# EAGLE design gigatron-sn76489 (EAGLE 9.6.2)
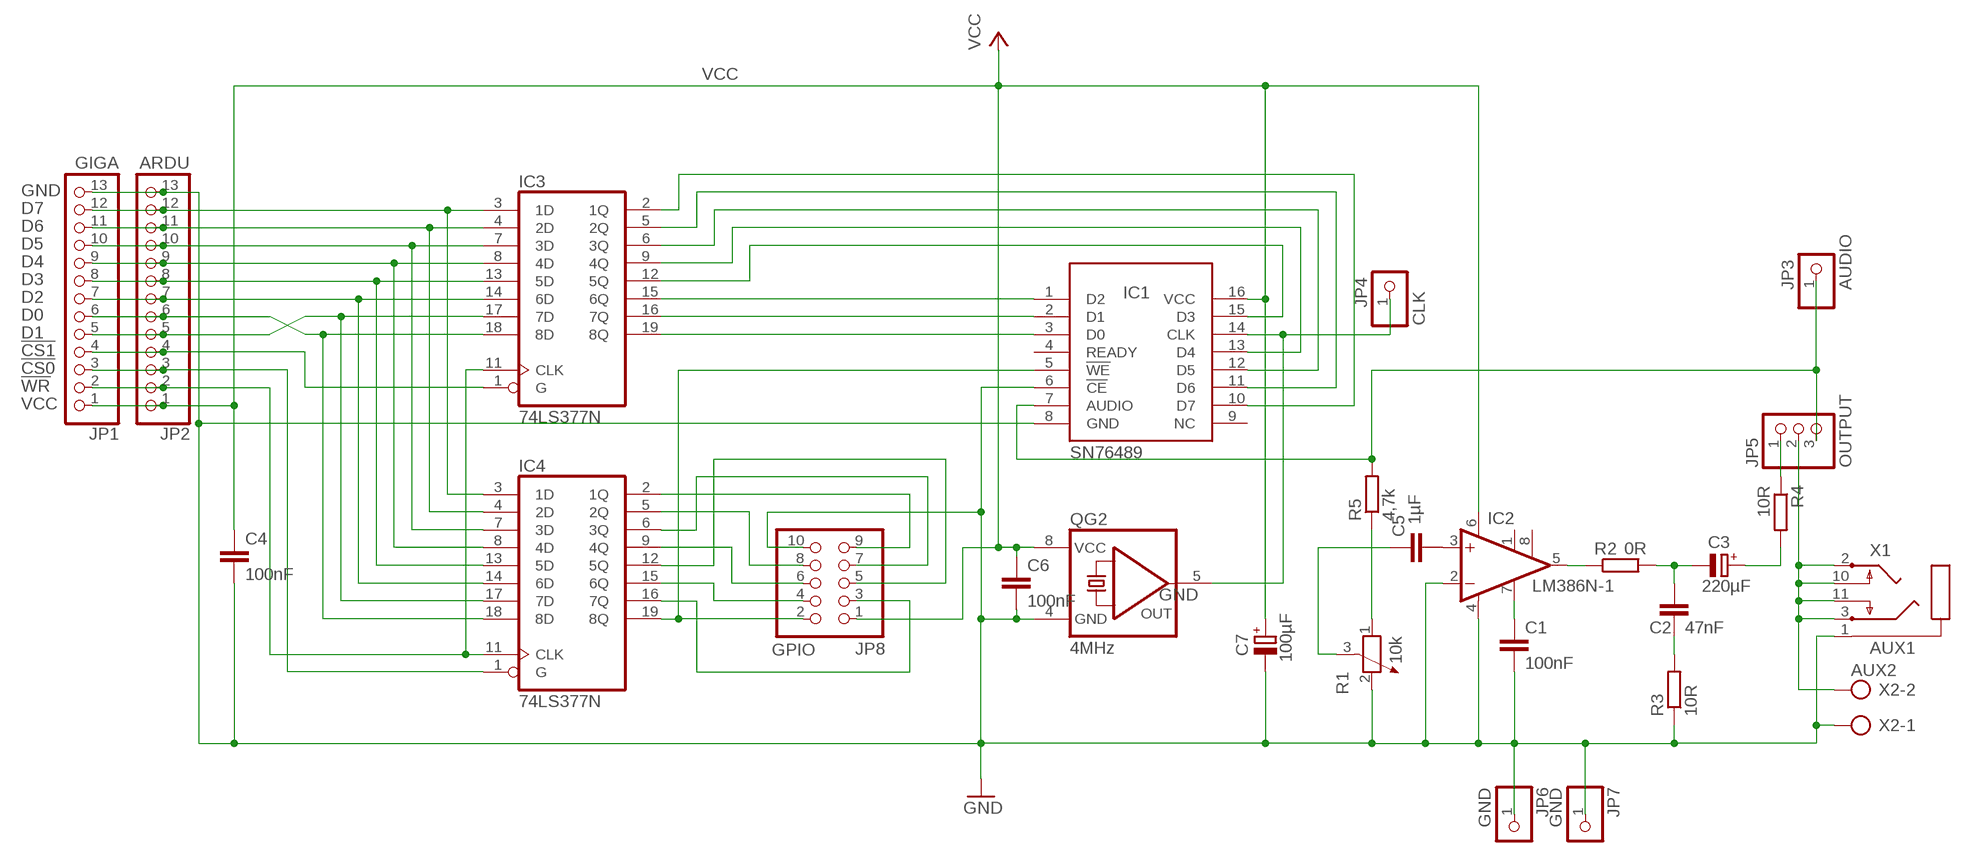
[diagram p0: schematic, sheet 1]

## Parts
C1  100nF  C-EU050-025X075  [C050-025X075]
C2  47nF  C-EU050-025X075  [C050-025X075]
C3  220µF  CPOL-EUE2.5-7  [E2,5-7]
C4  100nF  C-EU050-025X075  [C050-025X075]
C5  1µF  C-EU050-025X075  [C050-025X075]
C6  100nF  C-EU050-025X075  [C050-025X075]
C7  100µF  CPOL-EUE2.5-7  [E2,5-7]
IC1  SN76489  ALEX-PARTS_SN76489AN  [ALEX-PARTS_DIL16]
IC2  LM386N-1  [DIL08]
IC3  74LS377N  [DIL20]
IC4  74LS377N  [DIL20]
JP1  GIGA  PINHD-1X13/90  [1X13/90]
JP2  ARDU  PINHD-1X13  [1X13]
JP3  AUDIO  PINHD-1X1  [1X01]
JP4  CLK  PINHD-1X1  [1X01]
JP5  OUTPUT  PINHD-1X3  [1X03]
JP6  GND  PINHD-1X1  [1X01]
JP7  GND  PINHD-1X1  [1X01]
JP8  GPIO  PINHD-2X5  [2X05]
QG2  4MHz  QG5460  [DIL08S]
R1  10k  POTENTIOMETER_PT-10S  [PT-10S]
R2  0R  R-EU_0207/10  [0207/10]
R3  10R  R-EU_0207/10  [0207/10]
R4  10R  R-EU_0207/10  [0207/10]
R5  4,7k  R-EU_0207/10  [0207/10]
X1  AUX1  CON-SJ1-352XNSJ1-352XN  [SJ1-352XN]
X2  AUX2  AK500/2  [AK500/2]

## Nets
!CS0: IC4.1(G) JP1.3 JP2.3
!CS1: IC3.1(G) JP1.4 JP2.4
!SWR: IC1.5(!WE) IC4.19(8Q) JP8.2
!WR: IC3.11(CLK) IC4.11(CLK) JP1.2 JP2.2
AUXOUT: JP5.2 X1.2 X1.3 X1.10 X1.11 X2.2
CLK4MHZ: IC1.14(CLK) JP4.1 QG2.5(OUT)
D0: IC3.18(8D) IC4.18(8D) JP1.6 JP2.6
D1: IC3.17(7D) IC4.17(7D) JP1.5 JP2.5
D2: IC3.14(6D) IC4.14(6D) JP1.7 JP2.7
D3: IC3.13(5D) IC4.13(5D) JP1.8 JP2.8
D4: IC3.8(4D) IC4.8(4D) JP1.9 JP2.9
D5: IC3.7(3D) IC4.7(3D) JP1.10 JP2.10
D6: IC3.4(2D) IC4.4(2D) JP1.11 JP2.11
D7: IC3.3(1D) IC4.3(1D) JP1.12 JP2.12
GND: C1.2 C4.2 C6.2 C7.- IC1.6(!CE) IC1.8(GND) IC2.2(-IN) IC2.4(GND) JP1.13 JP2.13 JP6.1 JP7.1 JP8.10 QG2.4(GND) R1.2 R3.1 X1.1 X2.1
LM5: IC2.5(OUT) R2.1
LM7: C1.1 IC2.7(BYPASS)
N$1: C3.+ R4.2
N$2: JP5.1 R4.1
N$3: C5.2 IC2.3(+IN)
N$4: C5.1 R1.3
N$5: C2.2 R3.2
N$6: R1.1 R5.1
N$17: IC4.15(6Q) JP8.4
N$18: IC4.9(4Q) JP8.6
N$19: IC4.5(2Q) JP8.8
N$20: IC4.2(1Q) JP8.9
N$21: IC4.6(3Q) JP8.7
N$22: IC4.12(5Q) JP8.5
N$23: IC4.16(7Q) JP8.3
R2C2C3: C2.1 C3.- R2.2
SD0: IC1.3(D0) IC3.19(8Q)
SD1: IC1.2(D1) IC3.16(7Q)
SD2: IC1.1(D2) IC3.15(6Q)
SD3: IC1.15(D3) IC3.12(5Q)
SD4: IC1.13(D4) IC3.9(4Q)
SD5: IC1.12(D5) IC3.6(3Q)
SD6: IC1.11(D6) IC3.5(2Q)
SD7: IC1.10(D7) IC3.2(1Q)
SNOUT: IC1.7(AUDIO) JP3.1 JP5.3 R5.2
VCC: C4.1 C6.1 C7.+ IC1.16(VCC) IC2.6(VS) JP1.1 JP2.1 JP8.1 QG2.8(VCC)
Unconnected: IC1.4(READY) IC1.9(NC) IC2.1(GAIN) IC2.8(GAIN)

## Power pins joined to a net without a drawn wire
GND: IC3.10(GND) IC4.10(GND)
VCC: IC3.20(VCC) IC4.20(VCC)

## Library data of the parts
C1 C2 C4-C6 = rcl:C-EU: CAPACITOR, European symbol; SPICEPREFIX: C
C3 C7 = rcl:CPOL-EU: POLARIZED CAPACITOR, European symbol; SPICEPREFIX: C
IC1 = squareinator2:ALEX-PARTS_SN76489AN: TI SN76489AN Sound Generator
IC2 = linear:LM386?-*: Low Voltage Audio Power Amplifier Source: http://cache.national.com/ds/LM/LM386.pdf
IC3 IC4 = 74xx-eu:74*377: Octal D type FLIP FLOP, enable
JP1 JP2 = pinhead:PINHD-1X13: PIN HEADER
JP3 JP4 JP6 JP7 = pinhead:PINHD-1X1: PIN HEADER
JP5 = pinhead:PINHD-1X3: PIN HEADER
JP8 = pinhead:PINHD-2X5: PIN HEADER
QG2 = crystal:QG5460: CRYSTAL RESONATOR; OC_FARNELL: unknown; OC_NEWARK: unknown
R1 = rcl:POTENTIOMETER_: Potentiometer; SPICEMODEL: POT; SPICEPREFIX: X
R2-R5 = rcl:R-EU_: RESISTOR, European symbol; SPICEPREFIX: R
X1 = con-sj1-352xn:CON-SJ1-352XN: MIC/HEADPHONE JACK KS-S stereo microphone/headphone jack SJ1-352XN (CUD Devices)
X2 = con-ptr500:AK500/2: CONNECTOR; OC_FARNELL: unknown; OC_NEWARK: unknown

## Net classes
0 default: width 0.203 mm, clearance 0.203 mm

## Board
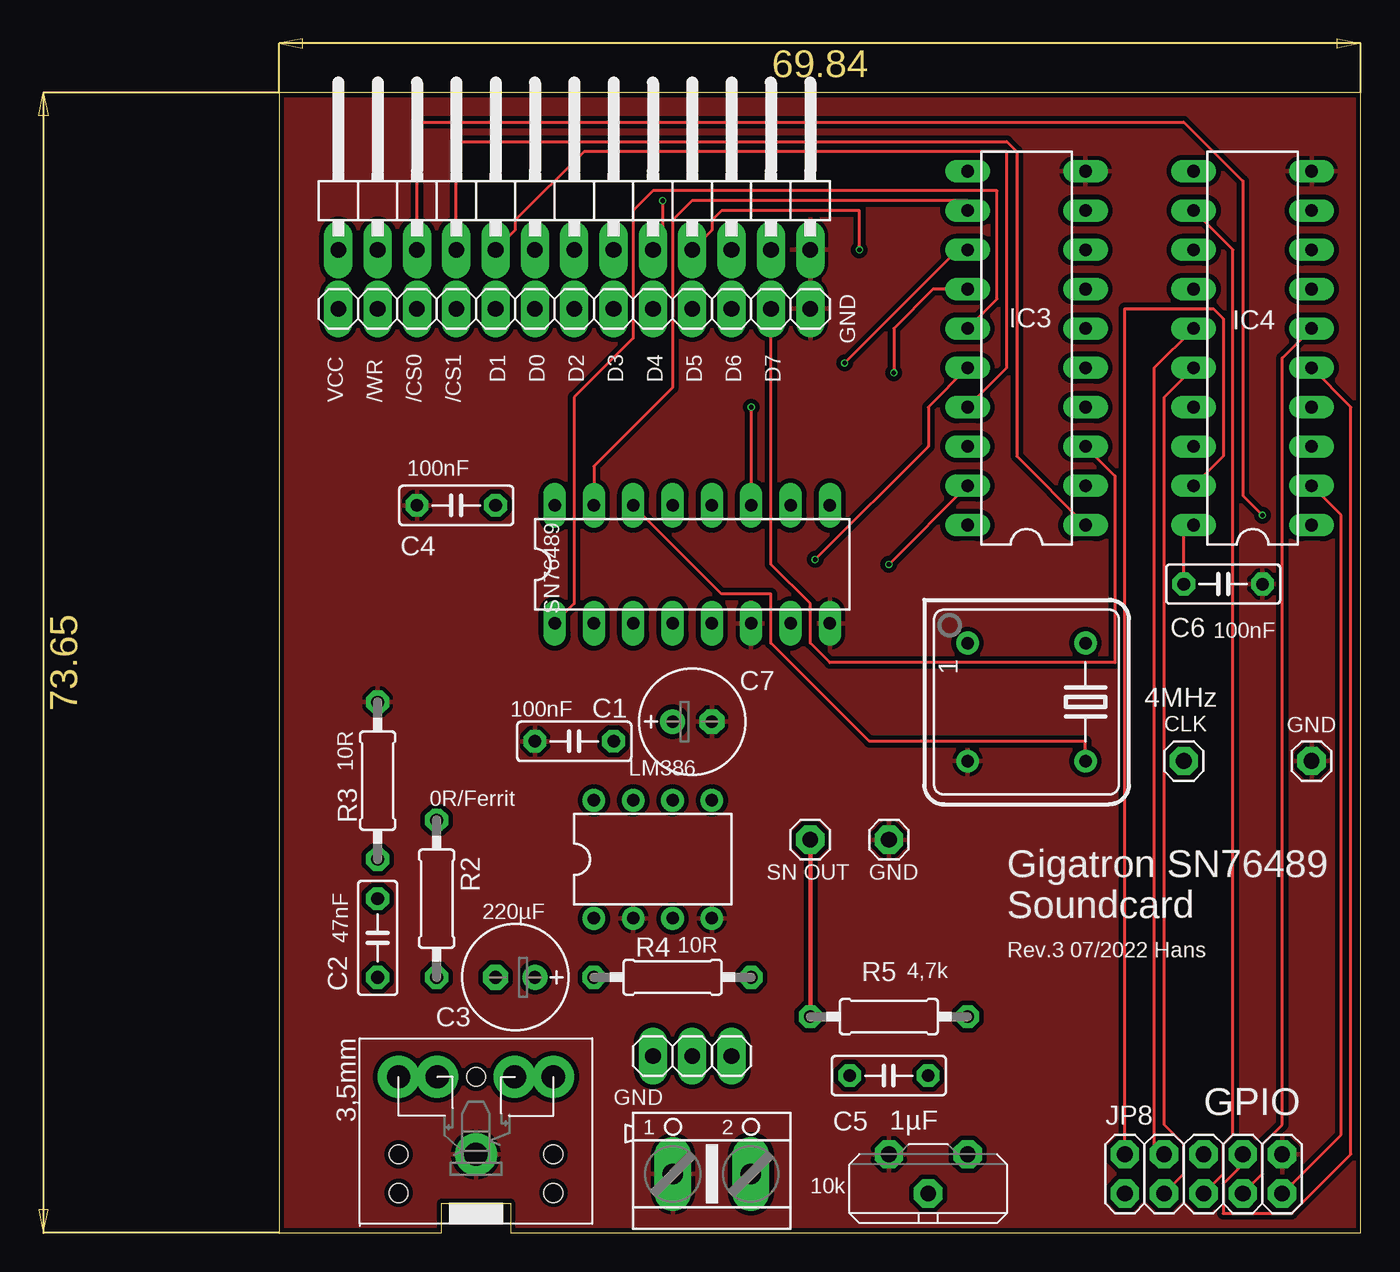
[diagram p1: board, top side]
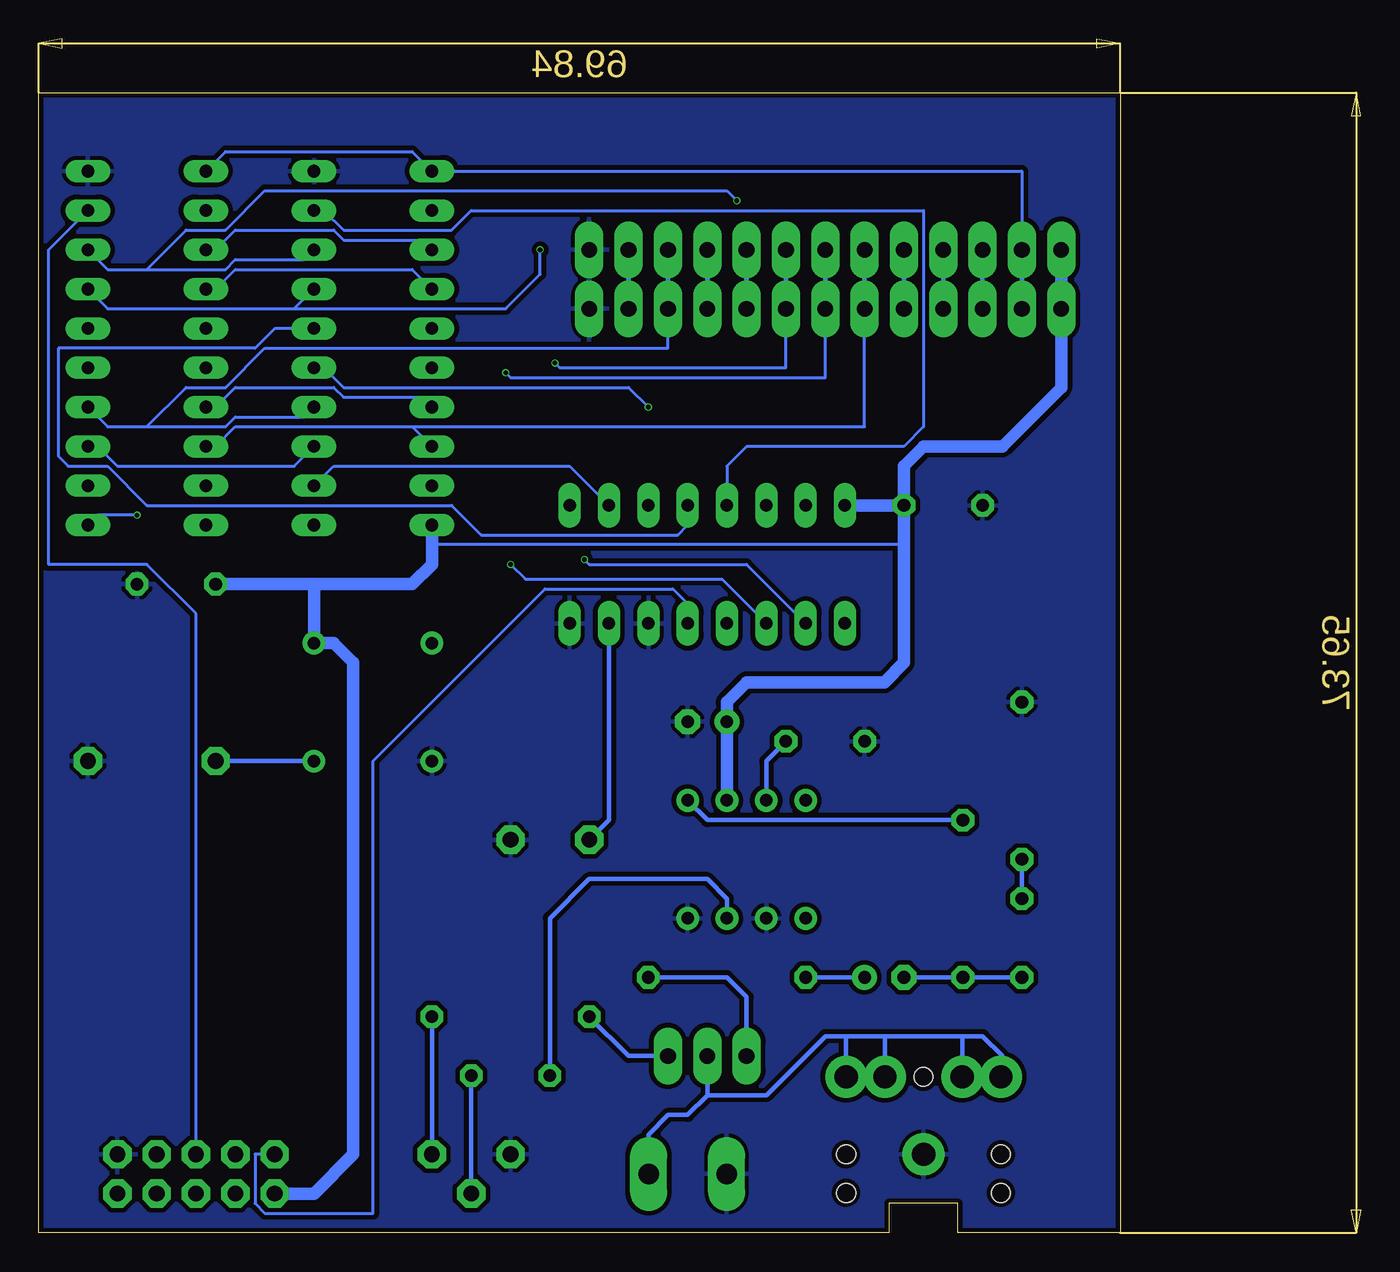
[diagram p2: board, bottom side, seen from below]

Size 69.85 x 73.65 mm. Coordinates in mm from the lower left corner, seen from the top.
Outline: 69.84,0 69.84,73.65 0,73.65 0,0 10.48,0 10.48,1.91 14.92,1.91 14.92,0 69.85,0
Copper layers (1*16): Top 0.035mm / dielectric 1.6mm / Bottom 0.035mm
Design rules "jlcpcb-2layers": minimum track width 5mil, minimum drill 0.3mm, track to track 5mil, track to pad 5mil, pad to pad 5mil, via to via 5mil, smd to smd 5mil, copper to edge 0.2mm, drill to drill 6mil, minimum pad ring 10mil, minimum via ring 3mil, stop-mask expansion 4mil, vias tented up to drill 0mil, thermal gap 10mil

### Footprints (pad centres in the part's own frame; a part is rotated, then mirrored left to right if it is on the bottom)
C050-025X075 = drill 0.813 octagon: 1 -2.54,0; 2 2.54,0
E2,5-7 = drill 0.813 pad 1.6: + -1.27,0 | drill 0.813 pad 1.6 octagon: - 1.27,0
ALEX-PARTS_DIL16 = drill 0.813 long: 1 -8.89,-3.81; 2 -6.35,-3.81; 3 -3.81,-3.81; 4 -1.27,-3.81; 5 1.27,-3.81; 6 3.81,-3.81; 7 6.35,-3.81; 8 8.89,-3.81; 9 8.89,3.81; 10 6.35,3.81; 11 3.81,3.81; 12 1.27,3.81; 13 -1.27,3.81; 14 -3.81,3.81; 15 -6.35,3.81; 16 -8.89,3.81
DIL08 = drill 0.813 pad 1.27: 1 -3.81,-3.81; 2 -1.27,-3.81; 3 1.27,-3.81; 4 3.81,-3.81; 5 3.81,3.81; 6 1.27,3.81; 7 -1.27,3.81; 8 -3.81,3.81
DIL20 = drill 0.813 long: 1 -11.43,-3.81; 2 -8.89,-3.81; 3 -6.35,-3.81; 4 -3.81,-3.81; 5 -1.27,-3.81; 6 1.27,-3.81; 7 3.81,-3.81; 8 6.35,-3.81; 9 8.89,-3.81; 10 11.43,-3.81; 11 11.43,3.81; 12 8.89,3.81; 13 6.35,3.81; 14 3.81,3.81; 15 1.27,3.81; 16 -1.27,3.81; 17 -3.81,3.81; 18 -6.35,3.81; 19 -8.89,3.81; 20 -11.43,3.81
1X13/90 = drill 1.016 long: 1 -15.24,-3.81; 2 -12.7,-3.81; 3 -10.16,-3.81; 4 -7.62,-3.81; 5 -5.08,-3.81; 6 -2.54,-3.81; 7 0,-3.81; 8 2.54,-3.81; 9 5.08,-3.81; 10 7.62,-3.81; 11 10.16,-3.81; 12 12.7,-3.81; 13 15.24,-3.81
1X13 = drill 1.016 long: 1 -15.24,0; 2 -12.7,0; 3 -10.16,0; 4 -7.62,0; 5 -5.08,0; 6 -2.54,0; 7 0,0; 8 2.54,0; 9 5.08,0; 10 7.62,0; 11 10.16,0; 12 12.7,0; 13 15.24,0
1X01 = drill 1.016 octagon: 1 0,0
1X03 = drill 1.016 long: 1 -2.54,0; 2 0,0; 3 2.54,0
2X05 = drill 1.016 octagon: 1 -5.08,-1.27; 2 -5.08,1.27; 3 -2.54,-1.27; 4 -2.54,1.27; 5 0,-1.27; 6 0,1.27; 7 2.54,-1.27; 8 2.54,1.27; 9 5.08,-1.27; 10 5.08,1.27
DIL08S = drill 0.813: 1 -3.81,-3.81; 4 3.81,-3.81; 5 3.81,3.81; 8 -3.81,3.81
PT-10S = drill 1.016 pad 1.778 octagon: 1 -2.54,-1.27; 2 2.54,-1.27; 3 0,1.27
0207/10 = drill 0.813 octagon: 1 -5.08,0; 2 5.08,0
SJ1-352XN = drill 1.5 pad 2.184: 1 0,0; 2 5,-5; 3 5,5; 10 5,-2.5; 11 5,2.5 | hole 1.2: 5,0; 0,5; 0,-5; -2.5,-5; -2.5,5
AK500/2 = drill 1.321 long: 1 -2.515,0; 2 2.515,0

### Placement (x,y rotation side)
C1  19.05,31.75 180 top
C2  6.35,19.05 90 top
C3  15.24,16.51 180 top
C4  11.43,46.99 180 top
C5  39.37,10.16 180 top
C6  60.96,41.91 0 top
C7  26.67,33.02 0 top
IC1  26.67,43.18 0 top
IC2  24.13,24.13 0 top
IC3  48.26,57.15 90 top
IC4  62.86,57.15 90 top
JP1  19.05,67.31 0 top
JP2  19.05,59.69 0 top
JP3  34.29,25.4 0 top
JP4  58.42,30.48 180 top
JP5  26.67,11.43 0 top
JP6  39.37,25.4 0 top
JP7  66.67,30.48 0 top
JP8  59.69,3.81 0 top
QG2  48.26,34.29 270 top
R1  41.91,3.81 180 top
R2  10.16,21.59 270 top
R3  6.35,29.21 270 top
R4  25.4,16.51 180 top
R5  39.37,13.97 180 top
X1  12.7,5.08 90 top
X2  27.94,3.81 0 top

### Tracks (layer width: path | path; a pad name or v marks a point on that pad's centre or on a via)
!CS0  (via drill 0.3)
  Top 0.203: v63.5,46.35 62.23,47.62 62.23,67.95 58.42,71.76 8.89,71.76 JP1.3
  Bottom 0.203: IC4.1 66.04,46.35 v63.5,46.35
  Bottom 0.305: JP1.3 JP2.3
!CS1
  Top 0.203: IC3.1 47.62,50.16 47.62,69.85 46.99,70.48 11.43,70.48 JP1.4
  Bottom 0.305: JP1.4 JP2.4
!SWR
  Top 0.203: IC4.19 60.96,50.16 60.96,59.05 60.32,59.69 54.61,59.69 JP8.2
  Bottom 0.203: IC1.5 27.94,40.64 28.89,41.59 37.15,41.59 48.26,30.48 48.26,1.27 55.24,1.27 55.88,1.91 55.88,5.08 JP8.2
!WR
  Bottom 0.203: IC4.11 57.78,69.85 45.72,69.85 IC3.11 6.35,68.58 JP1.2
  Bottom 0.305: JP1.2 JP2.2
AUXOUT
  Bottom 0.305: JP5.2 26.67,8.89 | 26.67,8.89 27.94,7.62 29.21,7.62 30.48,6.35 30.48,3.83 X2.2 | X1.3 7.7,11.35 7.62,11.43 8.89,12.7 10.16,12.7 | 10.16,12.7 15.24,12.7 | 15.24,12.7 17.78,12.7 | 17.78,12.7 19.05,12.7 22.86,8.89 26.67,8.89 | X1.11 10.2,12.66 10.16,12.7 | X1.10 15.2,12.66 15.24,12.7 | X1.2 17.7,12.62 17.78,12.7
CLK4MHZ
  Top 0.203: IC1.14 28.58,41.27 31.75,41.27 31.75,38.1 38.1,31.75 52.07,31.75 QG2.5
  Bottom 0.305: QG2.5 JP4.1
D0
  Bottom 0.203: 45.72,52.07 IC3.18 | 45.72,52.07 57.15,52.07 58.42,50.8 IC4.18 | JP2.6 16.51,52.07 45.72,52.07
  Bottom 0.305: JP1.6 JP2.6
D1
  Top 0.203: JP1.5 15.24,64.77 15.24,65.41 19.69,69.85 46.99,69.85 46.99,55.88 IC3.17
  Bottom 0.203: IC3.17 45.09,53.97 50.16,53.97 50.8,54.61 57.15,54.61 58.42,53.34 IC4.17
  Bottom 0.305: JP1.5 JP2.5
D2  (via drill 0.3)
  Top 0.203: IC3.14 42.23,60.96 39.69,58.42 v39.69,55.56
  Bottom 0.203: IC3.14 45.72,62.23 57.15,62.23 58.42,60.96 IC4.14 | JP2.7 19.05,55.24 39.37,55.24 v39.69,55.56
  Bottom 0.305: JP1.7 JP2.7
D3  (via drill 0.3)
  Top 0.203: IC3.13 43.81,63.5 v36.51,56.2
  Bottom 0.203: IC3.13 45.09,64.14 50.16,64.14 50.8,64.77 57.15,64.77 58.42,63.5 IC4.13 | JP2.8 21.59,55.88 36.2,55.88 v36.51,56.2
  Bottom 0.305: JP1.8 JP2.8
D4  (via drill 0.3)
  Top 0.203: JP1.9 24.77,64.14 v24.77,66.67
  Bottom 0.203: IC3.8 52.7,62.86 57.15,62.86 57.78,62.23 62.86,62.23 | 62.86,62.23 65.41,62.23 IC4.8 | v24.77,66.67 25.4,67.31 55.24,67.31 57.78,64.77 60.32,64.77 62.86,62.23
  Bottom 0.305: JP1.9 JP2.9
D5  (via drill 0.3)
  Top 0.203: JP1.10 27.94,64.77 27.94,65.41 28.58,66.04 37.46,66.04 v37.46,63.5
  Bottom 0.203: 53.34,59.69 IC3.7 | 53.34,59.69 65.41,59.69 IC4.7 | v37.46,63.5 37.46,61.91 39.69,59.69 53.34,59.69
  Bottom 0.305: JP1.10 JP2.10
D6
  Bottom 0.203: IC3.4 52.7,52.7 57.15,52.7 57.78,52.07 62.86,52.07 | 62.86,52.07 65.41,52.07 IC4.4 | JP2.11 29.21,57.15 55.24,57.15 57.78,54.61 60.32,54.61 62.86,52.07
  Bottom 0.305: JP1.11 JP2.11
D7
  Top 0.203: JP2.12 31.75,43.18 34.29,40.64 34.29,38.1 35.56,36.83 53.98,36.83 53.98,48.89 IC3.3
  Bottom 0.203: IC3.3 53.34,49.53 64.77,49.53 66.04,50.8 IC4.3
  Bottom 0.305: JP1.12 JP2.12
GND
  pour Bottom (isolate 0.305): 0,73.66 69.85,73.66 69.85,0 0,0
  pour Top (isolate 0.305): 0,73.66 0,0 69.85,0 69.85,73.66
LM5
  Bottom 0.305: R2.1 26.67,26.67 IC2.5
LM7
  Bottom 0.305: C1.1 22.86,30.48 IC2.7
N$1
  Bottom 0.305: C3.+ R4.2
N$2
  Bottom 0.305: JP5.1 24.13,15.24 25.4,16.51 R4.1
N$3
  Bottom 0.305: IC2.3 25.4,21.59 26.67,22.86 34.29,22.86 36.83,20.32 C5.2
N$4
  Bottom 0.305: R1.3 C5.1
N$5
  Bottom 0.305: C2.2 R3.2
N$6
  Bottom 0.305: R1.1 R5.1
N$17
  Top 0.203: IC4.15 56.52,55.88 56.52,5.71 JP8.4
N$18
  Bottom 0.203: IC4.9 69.22,63.5 69.22,43.18 62.86,43.18 59.69,40 JP8.6
N$19
  Top 0.203: IC4.5 69.22,53.34 69.22,5.08 65.41,1.27 60.96,1.27 60.96,3.17 62.23,4.45 JP8.8
N$20
  Top 0.203: IC4.2 68.58,46.35 68.58,6.35 JP8.9
N$21
  Top 0.203: IC4.6 64.77,56.52 64.77,6.99 63.5,5.71 63.5,3.81 JP8.7
N$22
  Top 0.203: IC4.12 61.59,63.5 61.59,6.35 60.96,5.71 60.96,3.81 JP8.5
N$23
  Top 0.203: IC4.16 57.15,53.97 57.15,6.99 58.42,5.71 58.42,3.81 JP8.3
R2C2C3
  Bottom 0.305: C2.1 R2.2 C3.-
SD0  (via drill 0.3)
  Top 0.203: IC3.19 v39.37,43.18
  Bottom 0.203: IC1.3 25.72,42.23 38.42,42.23 v39.37,43.18
SD1  (via drill 0.3)
  Top 0.203: v34.61,43.5 41.91,50.8 41.91,53.34 IC3.16
  Bottom 0.203: IC1.2 24.13,43.18 34.29,43.18 v34.61,43.5
SD2
  Top 0.203: IC1.1 19.05,40.64 19.05,53.97 22.86,57.78 22.86,66.04 24.13,67.31 46.35,67.31 46.35,60.32 IC3.15
SD3
  Top 0.203: IC1.15 20.32,49.53 25.4,54.61 25.4,65.41 26.67,66.67 44.45,66.67 IC3.12
SD4
  Bottom 0.203: IC1.13 25.4,49.53 24.13,50.8 13.97,50.8 12.7,52.07 12.7,66.04 41.91,66.04 43.18,64.77 50.16,64.77 51.43,66.04 IC3.9
SD5
  Bottom 0.203: IC1.12 27.94,45.72 28.58,45.09 41.27,45.09 43.18,46.99 62.86,46.99 65.41,49.53 67.95,49.53 68.58,50.16 68.58,57.15 55.88,57.15 54.61,58.42 IC3.6
SD6  (via drill 0.3)
  Top 0.203: v30.48,53.34 IC1.11
  Bottom 0.203: v30.48,53.34 31.75,54.61 50.16,54.61 51.43,55.88 IC3.5
SD7
  Bottom 0.203: IC1.10 35.56,49.53 50.8,49.53 IC3.2
SNOUT
  Top 0.305: JP3.1 R5.2
  Bottom 0.305: R5.2 31.75,11.43 JP5.3 | IC1.7 33.02,26.67 JP3.1
VCC
  Top 0.203: IC4.20 58.42,45.09 C6.1
  Bottom 0.203: 13.97,44.45 44.45,44.45
  Bottom 0.813: JP1.1 JP2.1 3.81,54.61 7.62,50.8 12.7,50.8 13.97,49.53 C4.1 | IC3.20 44.45,44.45 44.45,43.18 45.72,41.91 52.07,41.91 | 52.07,41.91 C6.1 | 52.07,41.91 QG2.8 50.8,38.1 49.53,36.83 49.53,5.08 52.07,2.54 JP8.1 | C4.1 IC1.16 | C4.1 13.97,44.45 13.97,36.83 15.24,35.56 24.13,35.56 25.4,34.29 C7.+ IC2.6

### Text on the board
tPlace: GND | D1 | D0 | D2 | D3 | D4 | D5 | D6 | D7 | VCC | /WR | /CS0 | /CS1 | 100nF | SN76489 | 100nF | 100nF | 4MHz | GND | CLK | 10R | LM386 | 0R/Ferrit | SN OUT | GND | 220µF | Gigatron SN76489 / Soundcard | 47nF | 10R | 4,7k | Rev.3 07/2022 Hans | GND | 1µF | GPIO | 10k | Audio